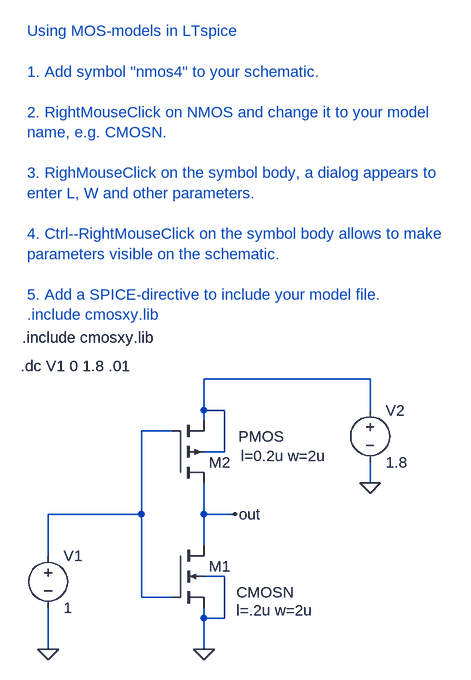
[diagram p0: schematic cmos_test1.asc]
cmos_test1.asc, the LTspice schematic file:
Version 4
SHEET 1 1180 1236
WIRE 0 112 0 48
WIRE 0 256 0 192
WIRE 144 48 0 48
WIRE 144 48 144 -80
WIRE 144 176 144 48
WIRE 192 -80 144 -80
WIRE 192 176 144 176
WIRE 240 -112 240 -160
WIRE 240 -96 240 -112
WIRE 240 48 240 0
WIRE 240 96 240 48
WIRE 240 208 240 192
WIRE 240 256 240 208
WIRE 272 -112 240 -112
WIRE 272 -48 240 -48
WIRE 272 -48 272 -112
WIRE 272 144 240 144
WIRE 272 208 240 208
WIRE 272 208 272 144
WIRE 288 48 240 48
WIRE 496 -160 240 -160
WIRE 496 -112 496 -160
WIRE 496 0 496 -32
FLAG 0 256 0
FLAG 496 0 0
FLAG 240 256 0
FLAG 288 48 out
SYMBOL nmos4 192 96 R0
WINDOW 3 98 72 Left 0
WINDOW 123 98 100 Left 0
SYMATTR Value CMOSN
SYMATTR Value2 l=.2u w=2u
SYMATTR InstName M1
SYMBOL voltage 0 96 R0
SYMATTR InstName V1
SYMATTR Value 1
SYMBOL voltage 496 -128 R0
SYMATTR InstName V2
SYMATTR Value 1.8
SYMBOL pmos4 192 0 M180
WINDOW 3 101 72 Left 0
WINDOW 123 105 42 Left 0
SYMATTR InstName M2
SYMATTR Value2 l=0.2u w=2u
TEXT -42 -180 Left 0 !.dc V1 0 1.8 .01
TEXT -40 -224 Left 0 !.include cmosxy.lib
TEXT -32 -696 Left 0 ;Using MOS-models in LTspice\n \n1. Add symbol "nmos4" to your schematic.\n \n2. RightMouseClick on NMOS and change it to your model \nname, e.g. CMOSN.\n \n3. RighMouseClick on the symbol body, a dialog appears to\nenter L, W and other parameters.\n \n4. Ctrl--RightMouseClick on the symbol body allows to make \nparameters visible on the schematic.\n \n5. Add a SPICE-directive to include your model file.\n.include cmosxy.lib

The netlist it stands for:
* cmos_test1.asc
M1 out N001 0 0 CMOSN l=.2u w=2u
V1 N001 0 1
V2 N002 0 1.8
M2 out N001 N002 N002 PMOS l=0.2u w=2u
.model NMOS NMOS
.model PMOS PMOS
.lib standard.mos
.dc V1 0 1.8 .01
.include cmosxy.lib
* Using MOS-models in LTspice
* 1. Add symbol "nmos4" to your schematic.
* 2. RightMouseClick on NMOS and change it to your model
* name, e.g. CMOSN.
* 3. RighMouseClick on the symbol body, a dialog appears to
* enter L, W and other parameters.
* 4. Ctrl--RightMouseClick on the symbol body allows to make
* parameters visible on the schematic.
* 5. Add a SPICE-directive to include your model file.
* .include cmosxy.lib
.backanno
.end